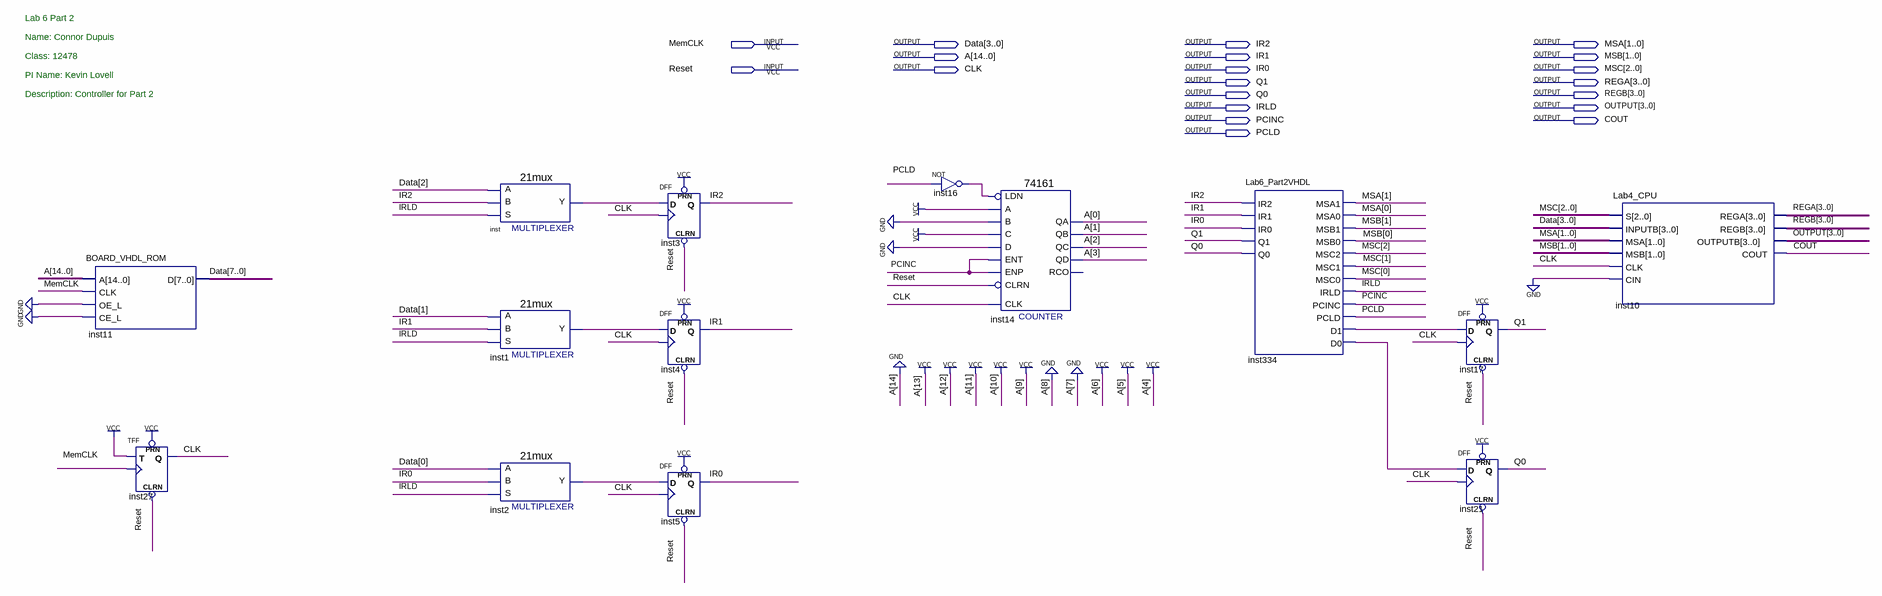
[diagram p0: schematic sheet]
// Quartus schematic Lab6_Part2_VHDL_ROM.bdf as structural Verilog: 14 symbols, 20 pins
module Lab6_Part2_VHDL_ROM (
  input  MemCLK,
  input  Reset,
  output [7:0] Data,
  output IR2,
  output [1:0] MSA,
  output [14:0] A,
  output IR1,
  output [1:0] MSB,
  output CLK,
  output IR0,
  output [2:0] MSC,
  output Q1,
  output [3:0] REGA,
  output Q0,
  output [3:0] REGB,
  output IRLD,
  output [3:0] OUTPUT,
  output PCINC,
  output COUT,
  output PCLD
);

  wire inst1_y, inst2_y, inst16_out, inst334_d0, inst334_d1, inst_y;

  BOARD_VHDL_ROM inst11 (.A({11'b01111100111, A[3:0]}), .CLK(MemCLK), .OE_L(1'b0), .CE_L(1'b0), .D(Data));
  TFF inst27 (.PRN(1'b1), .CLRN(Reset), .T(1'b1), .CLK(MemCLK), .Q(CLK));
  \21mux  inst (.S(IRLD), .B(IR2), .A(Data[2]), .Y(inst_y));
  \21mux  inst1 (.S(IRLD), .B(IR1), .A(Data[1]), .Y(inst1_y));
  \21mux  inst2 (.S(IRLD), .B(IR0), .A(Data[0]), .Y(inst2_y));
  DFF inst3 (.CLRN(Reset), .CLK(CLK), .D(inst_y), .PRN(1'b1), .Q(IR2));
  DFF inst4 (.CLRN(Reset), .CLK(CLK), .D(inst1_y), .PRN(1'b1), .Q(IR1));
  DFF inst5 (.CLRN(Reset), .CLK(CLK), .D(inst2_y), .PRN(1'b1), .Q(IR0));
  not inst16 (inst16_out, PCLD);
  \74161  inst14 (
    .CLRN(Reset), .CLK(CLK), .ENP(PCINC), .LDN(inst16_out), .A(1'b1), .D(1'b0), .ENT(PCINC), .B(1'b0),
    .C(1'b1), .QD(A[3]), .QC(A[2]), .QB(A[1]), .QA(A[0]));  // open: RCO
  Lab6_Part2VHDL inst334 (
    .IR2(IR2), .IR1(IR1), .IR0(IR0), .Q1(Q1), .Q0(Q0), .MSA1(MSA[1]), .MSA0(MSA[0]), .MSB1(MSB[1]),
    .MSB0(MSB[0]), .MSC2(MSC[2]), .MSC1(MSC[1]), .MSC0(MSC[0]), .IRLD(IRLD), .PCINC(PCINC), .PCLD(PCLD),
    .D1(inst334_d1), .D0(inst334_d0));
  DFF inst17 (.CLRN(Reset), .CLK(CLK), .D(inst334_d1), .PRN(1'b1), .Q(Q1));
  DFF inst21 (.CLRN(Reset), .CLK(CLK), .D(inst334_d0), .PRN(1'b1), .Q(Q0));
  Lab4_CPU inst10 (
    .S(MSC), .INPUTB(Data[3:0]), .MSA(MSA), .MSB(MSB), .CLK(CLK), .CIN(1'b0), .REGA(REGA), .REGB(REGB),
    .OUTPUTB(OUTPUT), .COUT(COUT));

  assign A[14:4] = 11'b01111100111;

  // Notes on the sheet:
  //   Lab 6 Part 2
  //   Name: Connor Dupuis
  //   Class: 12478
  //   PI Name: Kevin Lovell
  //   Description: Controller for Part 2
endmodule
